# Altium project BJTTSFP-4-1_DCBias.PrjPcb
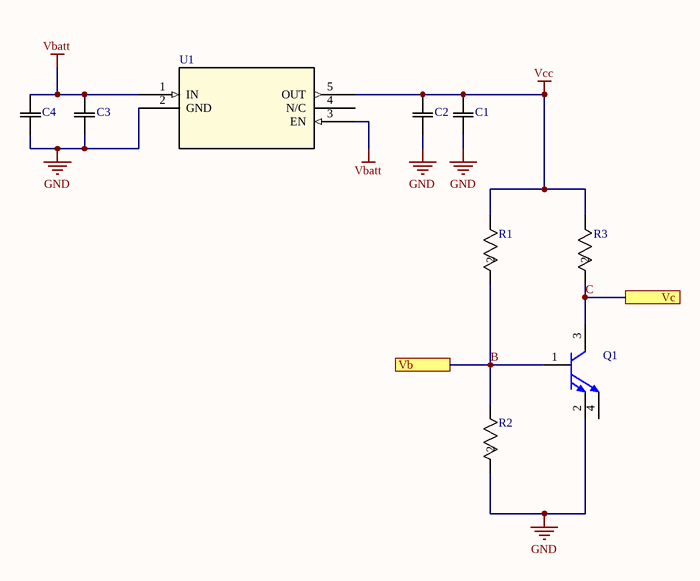
[diagram p0: BJTTSFP-4-1_DCBias.SchDoc]
1 sheet, 9 parts. Net scope: flat (ports and power ports of the same name join across sheets).
Board file: BJTTSFP-4-1_DCBias.PcbDoc

## Sheet BJTTSFP-4-1_DCBias.SchDoc
size A4

### Parts
C1  (no value)  [YAG_CC0402]
C2  (no value)  [YAG_CC0402]
C3  (no value)  [YAG_CC0402]
C4  (no value)  [YAG_CC0402]
Q1  (no value)  [INF-TSFP-4-1_V]
R1  (no value)  [RC0402N]
R2  (no value)  [RC0402N]
R3  (no value)  [RC0402N]
U1  (no value)  [DBV5]

### Ports
Vb, Vc

### Nets
GND: C1.1 C2.1 C3.1 C4.1 Q1.2(E) R2.2 U1.2(GND)
Vbatt: C3.2 C4.2 U1.1(IN) U1.3(EN)
Vcc: C1.2 C2.2 R1.1 R3.1 U1.5(OUT)
B: Q1.1(B) R1.2 R2.1 ; port Vb
C: Q1.3(C) R3.2 ; port Vc

Not connected (* = marked no-connect by the designer): Q1 4(E); U1 4(N/C)

### Library data of the parts
C1-C4 = CC0402KRX7R9BB10: No Description Available; Manufacturer_Part_Number: CC0402KRX7R9BB103; Vendor: Yageo; Built_By: EMA_UL_Team; Type: DEV; Copyright: Copyright (C) 2018 Accelerated Designs. All rights reserved; RefDes: RefDes; Value: Value
Q1 = BFP720F: SiGe:C Heterojunction Wideband RF Bipolar Transistor, 4 V VCEO, 20 mA IC, 26 dB Gmax, TSFP-4-1, Green; Manufacturer: Infineon; Gmax (typ): 26 dB; Green: yes; Group: Ultra low noise SiGe; IC (max): 20 mA; NFmin (typ): 0.5 dB; Ptot (max): 80mW; VCEO (max): 4 V; DatasheetVersion: Rev. 1.0; PackageReference: TSFP-4-1; PackageDescription: 4-Pin Thin Small Flat Package, 0.8 x 1.4 mm Body, 0.5 mm Pitch; Halogen-free: yes; Mounting Technology: Surface Mount; PartNumber: BFP720F; ComponentLink1Description: Manufacturer URL; ComponentLink1URL: http://www.infineon.com/; ComponentLink2Description: Datasheet; ComponentLink2URL: http://www.infineon.com/dgdl/bfp720f.pdf?folderId=db3a30431400ef68011425b291f205c5&fileId=db3a30431ddc9372011e2673bdbf4727&location=en.Products.RF.RF_Transistors_.Ultra_Low_Noise_SiGe_C_Transistors_for_use_up_to_12_GHz.DATASHEET.bfp720f.pdf; ComponentLink3Description: Package Specification; ComponentLink3URL: http://www.infineon.com/dgdl/TSFP-4-1%2C-2-Package_Overview.pdf?folderId=db3a30431936bc4b011953b7d203683d&fileId=db3a30431936bc4b011953c249663734
R1-R3 = RC0402JR-070RL: No Description Available; Vendor: Yageo; Built_By: EMA_UL_Team; Manufacturer_Part_Number: RC0402JR-070RL; Copyright: Copyright (C) 2018 Accelerated Designs. All rights reserved; RefDes: RefDes; Type: DEV; Value: Value
U1 = LP5907MFX-3.3/NO: No Description Available; Manufacturer_Part_Number: LP5907MFX-3.3/NOPB; Vendor: Texas Instruments; Built_By: EMA_UL_Team; Copyright: Copyright (C) 2018 Accelerated Designs. All rights reserved; RefDes: RefDes; Type: DEV; Value: Value